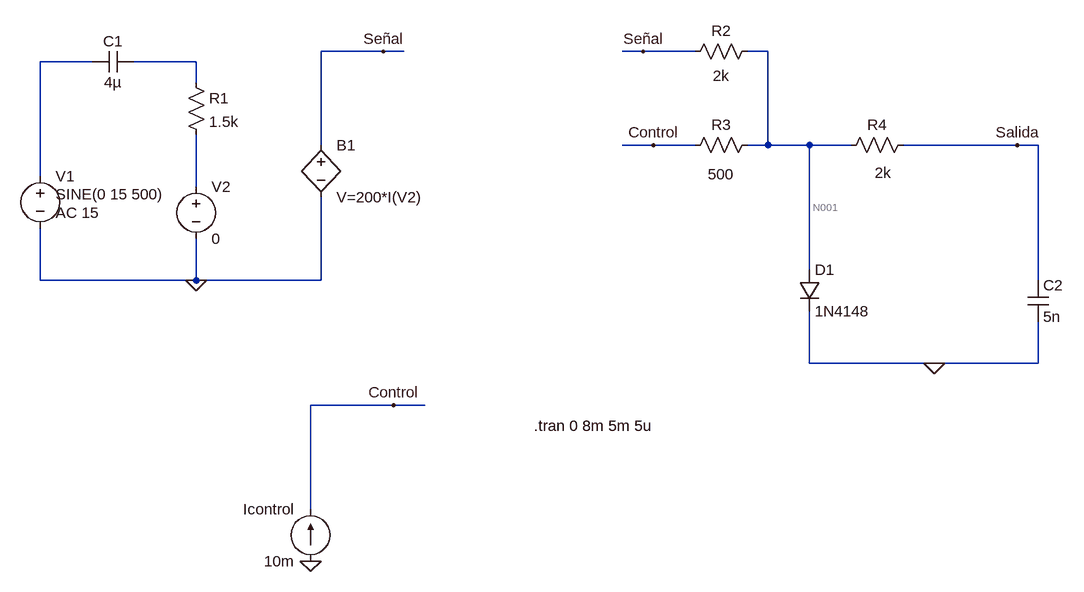
[diagram p0: schematic tutorialP1.asc]
tutorialP1.asc, the LTspice schematic file:
Version 4
SHEET 1 1212 680
WIRE 128 -720 32 -720
WIRE 160 -720 128 -720
WIRE 528 -720 496 -720
WIRE 608 -720 528 -720
WIRE 720 -720 688 -720
WIRE -320 -704 -400 -704
WIRE -160 -704 -256 -704
WIRE -160 -672 -160 -704
WIRE 32 -576 32 -720
WIRE 544 -576 496 -576
WIRE 608 -576 544 -576
WIRE 720 -576 720 -720
WIRE 720 -576 688 -576
WIRE 784 -576 720 -576
WIRE 848 -576 784 -576
WIRE 1104 -576 928 -576
WIRE 1136 -576 1104 -576
WIRE -400 -528 -400 -704
WIRE -160 -512 -160 -592
WIRE 784 -384 784 -576
WIRE -400 -368 -400 -448
WIRE -160 -368 -160 -432
WIRE -160 -368 -400 -368
WIRE 32 -368 32 -496
WIRE 32 -368 -160 -368
WIRE 1136 -368 1136 -576
WIRE 784 -240 784 -320
WIRE 976 -240 784 -240
WIRE 1136 -240 1136 -304
WIRE 1136 -240 976 -240
WIRE 144 -176 16 -176
WIRE 192 -176 144 -176
WIRE 16 -16 16 -176
FLAG 16 64 0
FLAG -160 -368 0
FLAG 976 -240 0
FLAG 144 -176 Control
FLAG 528 -720 Señal
FLAG 544 -576 Control
FLAG 1104 -576 Salida
FLAG 128 -720 Señal
SYMBOL cap -256 -720 R90
WINDOW 0 0 32 VBottom 2
WINDOW 3 32 32 VTop 2
SYMATTR InstName C1
SYMATTR Value 4µ
SYMBOL res -176 -688 R0
SYMATTR InstName R1
SYMATTR Value 1.5k
SYMBOL res 704 -736 R90
WINDOW 0 0 56 VBottom 2
WINDOW 3 38 56 VTop 2
SYMATTR InstName R2
SYMATTR Value 2k
SYMBOL res 704 -592 R90
WINDOW 0 0 56 VBottom 2
WINDOW 3 45 56 VTop 2
SYMATTR InstName R3
SYMATTR Value 500
SYMBOL res 944 -592 R90
WINDOW 0 0 56 VBottom 2
WINDOW 3 43 47 VTop 2
SYMATTR InstName R4
SYMATTR Value 2k
SYMBOL cap 1120 -368 R0
SYMATTR InstName C2
SYMATTR Value 5n
SYMBOL voltage -400 -544 R0
WINDOW 3 24 44 Left 2
WINDOW 123 24 72 Left 2
WINDOW 39 0 0 Left 2
SYMATTR InstName V1
SYMATTR Value SINE(0 15 500)
SYMATTR Value2 AC 15
SYMBOL voltage -160 -528 R0
WINDOW 123 0 0 Left 2
WINDOW 39 0 0 Left 2
SYMATTR InstName V2
SYMATTR Value 0
SYMBOL bv 32 -592 R0
SYMATTR InstName B1
SYMATTR Value V=200*I(V2)
SYMBOL diode 768 -384 R0
SYMATTR InstName D1
SYMATTR Value 1N4148
SYMBOL current 16 64 R180
WINDOW 0 24 80 Left 2
WINDOW 3 24 0 Left 2
WINDOW 123 0 0 Left 2
WINDOW 39 0 0 Left 2
SYMATTR InstName Icontrol
SYMATTR Value 10m
TEXT 360 -144 Left 2 !.tran 0 8m 5m 5u

The netlist it stands for:
* tutorialP1.asc
C1 N003 N002 4µ
R1 N003 N004 1.5k
R2 N001 Señal 2k
R3 N001 Control 500
R4 Salida N001 2k
C2 Salida 0 5n
V1 N002 0 SINE(0 15 500) AC 15
V2 N004 0 0
B1 Señal 0 V=200*I(V2)
D1 N001 0 1N4148
Icontrol 0 Control 10m
.model D D
.lib standard.dio
.tran 0 8m 5m 5u
.backanno
.end

* Results of the author's LTspice run, read from the files saved beside the schematic
* Operating Point, zero values left out:
*   V(n001) = 692.4 mV
*   V(control) = 5.692 V
*   V(salida) = 692.4 mV
*   I(B1) = 346.2 µA
*   I(D1) = 9.654 mA
*   I(Icontrol) = 10 mA
*   I(R3) = -10 mA
*   I(R2) = 346.2 µA
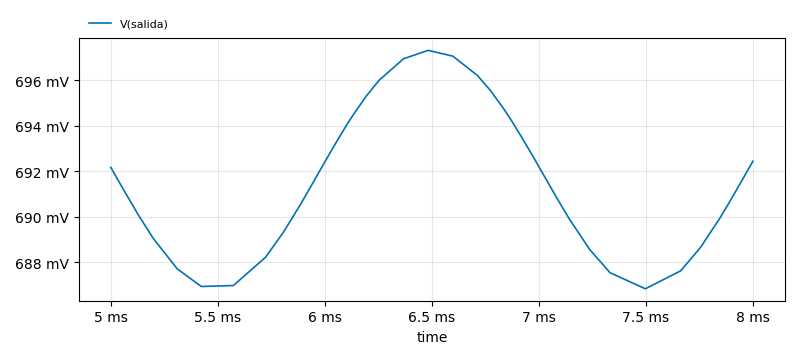
[diagram p1: Transient Analysis of tutorialP1.asc, plotted from the saved traces]
* Transient Analysis, 1 run:
*   V(salida): min 686.8 mV, max 697.3 mV, average 691.1 mV, rms 691.1 mV, last 692.4 mV